# EAGLE design sensorHub (EAGLE 9.6.2)
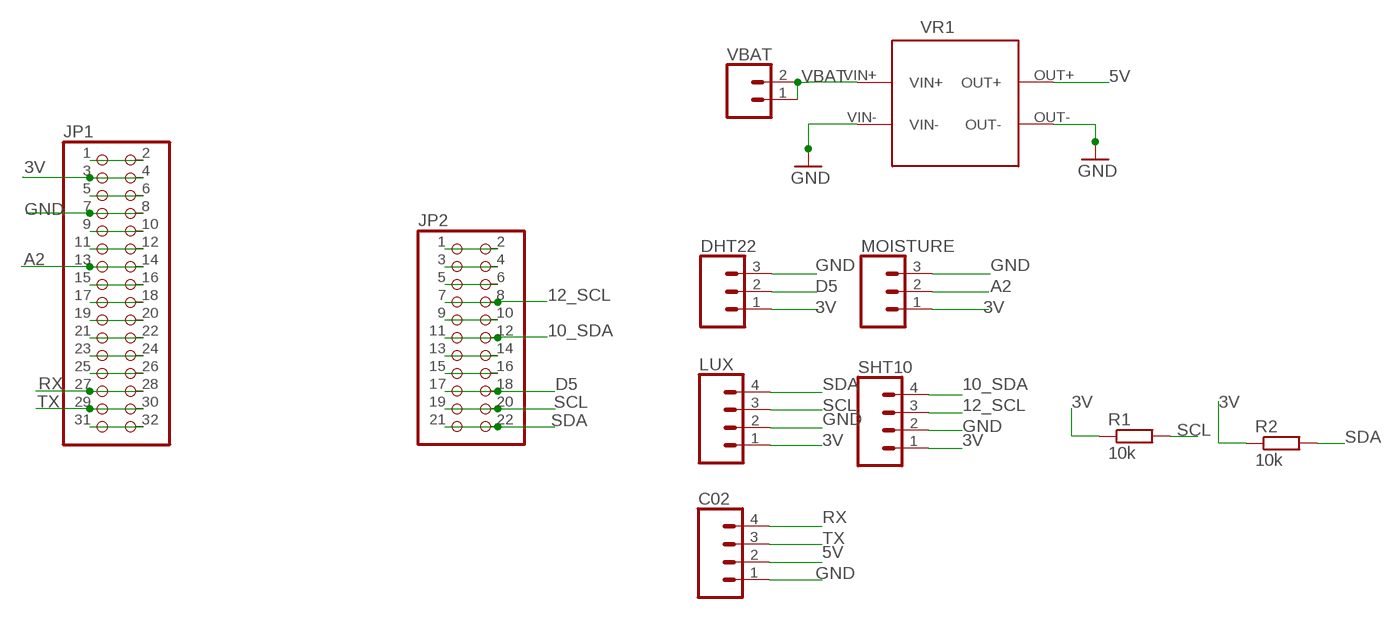
[diagram p0: schematic, sheet 1]

## Parts
C02  CONN_04SCREW  [SCREWTERMINAL-3.5MM-4]
DHT22  CONN_03SCREW  [SCREWTERMINAL-3.5MM-3]
JP1  PINHD-2X16  [2X16]
JP2  PINHD-2X11  [2X11]
LUX  CONN_04SCREW  [SCREWTERMINAL-3.5MM-4]
MOISTURE  CONN_03SCREW  [SCREWTERMINAL-3.5MM-3]
R1  10k  R-EU_0207/10  [0207/10]
R2  10k  R-EU_0207/10  [0207/10]
SHT10  CONN_04SCREW  [SCREWTERMINAL-3.5MM-4]
VBAT  CONN_02  [1X02]
VR1  MT3608THROUGH_HOLE  [MT3608]

## Nets
3V: DHT22.1 JP1.3 JP1.4 LUX.1 MOISTURE.1 R1.1 R2.1 SHT10.1
5V: C02.2 VR1.OUT+
10_SDA: JP2.11 JP2.12 SHT10.4
12_SCL: JP2.7 JP2.8 SHT10.3
A2: JP1.13 JP1.14 MOISTURE.2
D5: DHT22.2 JP2.17 JP2.18
GND: C02.1 DHT22.3 JP1.7 JP1.8 LUX.2 MOISTURE.3 SHT10.2 VR1.OUT- VR1.VIN-
N$1: JP1.1 JP1.2
N$3: JP1.5 JP1.6
N$5: JP1.9 JP1.10
N$6: JP1.11 JP1.12
N$8: JP1.15 JP1.16
N$9: JP1.17 JP1.18
N$10: JP1.19 JP1.20
N$11: JP1.21 JP1.22
N$12: JP1.23 JP1.24
N$13: JP1.25 JP1.26
N$16: JP1.31 JP1.32
N$17: JP2.1 JP2.2
N$18: JP2.3 JP2.4
N$19: JP2.5 JP2.6
N$21: JP2.9 JP2.10
N$23: JP2.13 JP2.14
N$24: JP2.15 JP2.16
RX: C02.4 JP1.27 JP1.28
SCL: JP2.19 JP2.20 LUX.3 R1.2
SDA: JP2.21 JP2.22 LUX.4 R2.2
TX: C02.3 JP1.29 JP1.30
VBAT: VBAT.1 VBAT.2 VR1.VIN+

## Library data of the parts
C02 LUX SHT10 = SparkFun-Connectors:CONN_04: Multi connection point. Often used as Generic Header-pin footprint for 0.1 inch spaced/style header connections On any of the 0.1 inch spaced packages, you can populate with these: Break Away Headers - Straight <https://www.sparkfun.com/products/116> (PRT-00116) Break Away Male Headers - Right Angle <https://www.sparkfun.com/products/553> (PRT-00553) Female Headers <https://www.sparkfun.com/products/115> (PRT-00115) Break Away Headers - Machine Pin <https://www.sparkfun.com/products/117> (PRT-00117) Break Away Female Headers - Swiss Machine Pin <https://www.sparkfun.com/products/743> (PRT-00743) For SCREWTERMINALS and SPRING TERMINALS visit here: Screw Terimnals on SparkFun.com <https://www.sparkfun.com/search/results?term=Screw+Terminals> (5mm/3.5mm/2.54mm spacing) This device is also useful as a general connection point to wire up your design to another part of your project. Our various solder wires solder well into these plated through hole pads. Hook-Up Wire - Assortment (Stranded, 22 AWG) <https://www.sparkfun.com/products/11375> (PRT-11375) Hook-Up Wire - Assortment (Solid Core, 22 AWG) <https://www.sparkfun.com/products/11367> (PRT-11367) View the entire wire category on our website here <https://www.sparkfun.com/categories/141> Special notes: Molex polarized connector foot print use with SKU : PRT-08231 with associated crimp pins and housings. 1MM SMD Version SKU: PRT-10208; PROD_ID: 2xCONN-08399; SF_ID: 2xPRT-08084
DHT22 MOISTURE = SparkFun-Connectors:CONN_03: Multi connection point. Often used as Generic Header-pin footprint for 0.1 inch spaced/style header connections On any of the 0.1 inch spaced packages, you can populate with these: Break Away Headers - Straight <https://www.sparkfun.com/products/116> (PRT-00116) Break Away Male Headers - Right Angle <https://www.sparkfun.com/products/553> (PRT-00553) Female Headers <https://www.sparkfun.com/products/115> (PRT-00115) Break Away Headers - Machine Pin <https://www.sparkfun.com/products/117> (PRT-00117) Break Away Female Headers - Swiss Machine Pin <https://www.sparkfun.com/products/743> (PRT-00743) Stackable Header - 3 Pin (Female, 0.1") <https://www.sparkfun.com/products/13875> (PRT-13875) For SCREWTERMINALS and SPRING TERMINALS visit here: Screw Terimnals on SparkFun.com <https://www.sparkfun.com/search/results?term=Screw+Terminals> (5mm/3.5mm/2.54mm spacing) This device is also useful as a general connection point to wire up your design to another part of your project. Our various solder wires solder well into these plated through hole pads. Hook-Up Wire - Assortment (Stranded, 22 AWG) <https://www.sparkfun.com/products/11375> (PRT-11375) Hook-Up Wire - Assortment (Solid Core, 22 AWG) <https://www.sparkfun.com/products/11367> (PRT-11367) View the entire wire category on our website here <https://www.sparkfun.com/categories/141> Special notes: Molex polarized connector foot print use with SKU : PRT-08232 with associated crimp pins and housings.; PROD_ID: CONN-08288; SF_ID: PRT-08235
JP1 = pinhead:PINHD-2X16: PIN HEADER
JP2 = pinhead:PINHD-2X11: PIN HEADER
R1 R2 = resistor:R-EU_: RESISTOR, European symbol
VBAT = SparkFun-Connectors:CONN_02: Multi connection point. Often used as Generic Header-pin footprint for 0.1 inch spaced/style header connections On any of the 0.1 inch spaced packages, you can populate with these: Break Away Headers - Straight <https://www.sparkfun.com/products/116> (PRT-00116) Break Away Male Headers - Right Angle <https://www.sparkfun.com/products/553> (PRT-00553) Female Headers <https://www.sparkfun.com/products/115> (PRT-00115) Break Away Headers - Machine Pin <https://www.sparkfun.com/products/117> (PRT-00117) Break Away Female Headers - Swiss Machine Pin <https://www.sparkfun.com/products/743> (PRT-00743) For SCREWTERMINALS and SPRING TERMINALS visit here: Screw Terimnals on SparkFun.com <https://www.sparkfun.com/search/results?term=Screw+Terminals> (5mm/3.5mm/2.54mm spacing) This device is also useful as a general connection point to wire up your design to another part of your project. Our various solder wires solder well into these plated through hole pads. Hook-Up Wire - Assortment (Stranded, 22 AWG) <https://www.sparkfun.com/products/11375> (PRT-11375) Hook-Up Wire - Assortment (Solid Core, 22 AWG) <https://www.sparkfun.com/products/11367> (PRT-11367) View the entire wire category on our website here <https://www.sparkfun.com/categories/141> Special notes: Molex polarized connector foot print use with: PRT-08233 with associated crimp pins and housings. 2.54_SCREWTERM for use with PRT-10571. 3.5mm Screw Terminal footprints for PRT-08084 5mm Screw Terminal footprints for use with PRT-08432
VR1 = lm2577_module:MT3608: This is the LM2577 device forMT3608 package with a usb connector

## Board
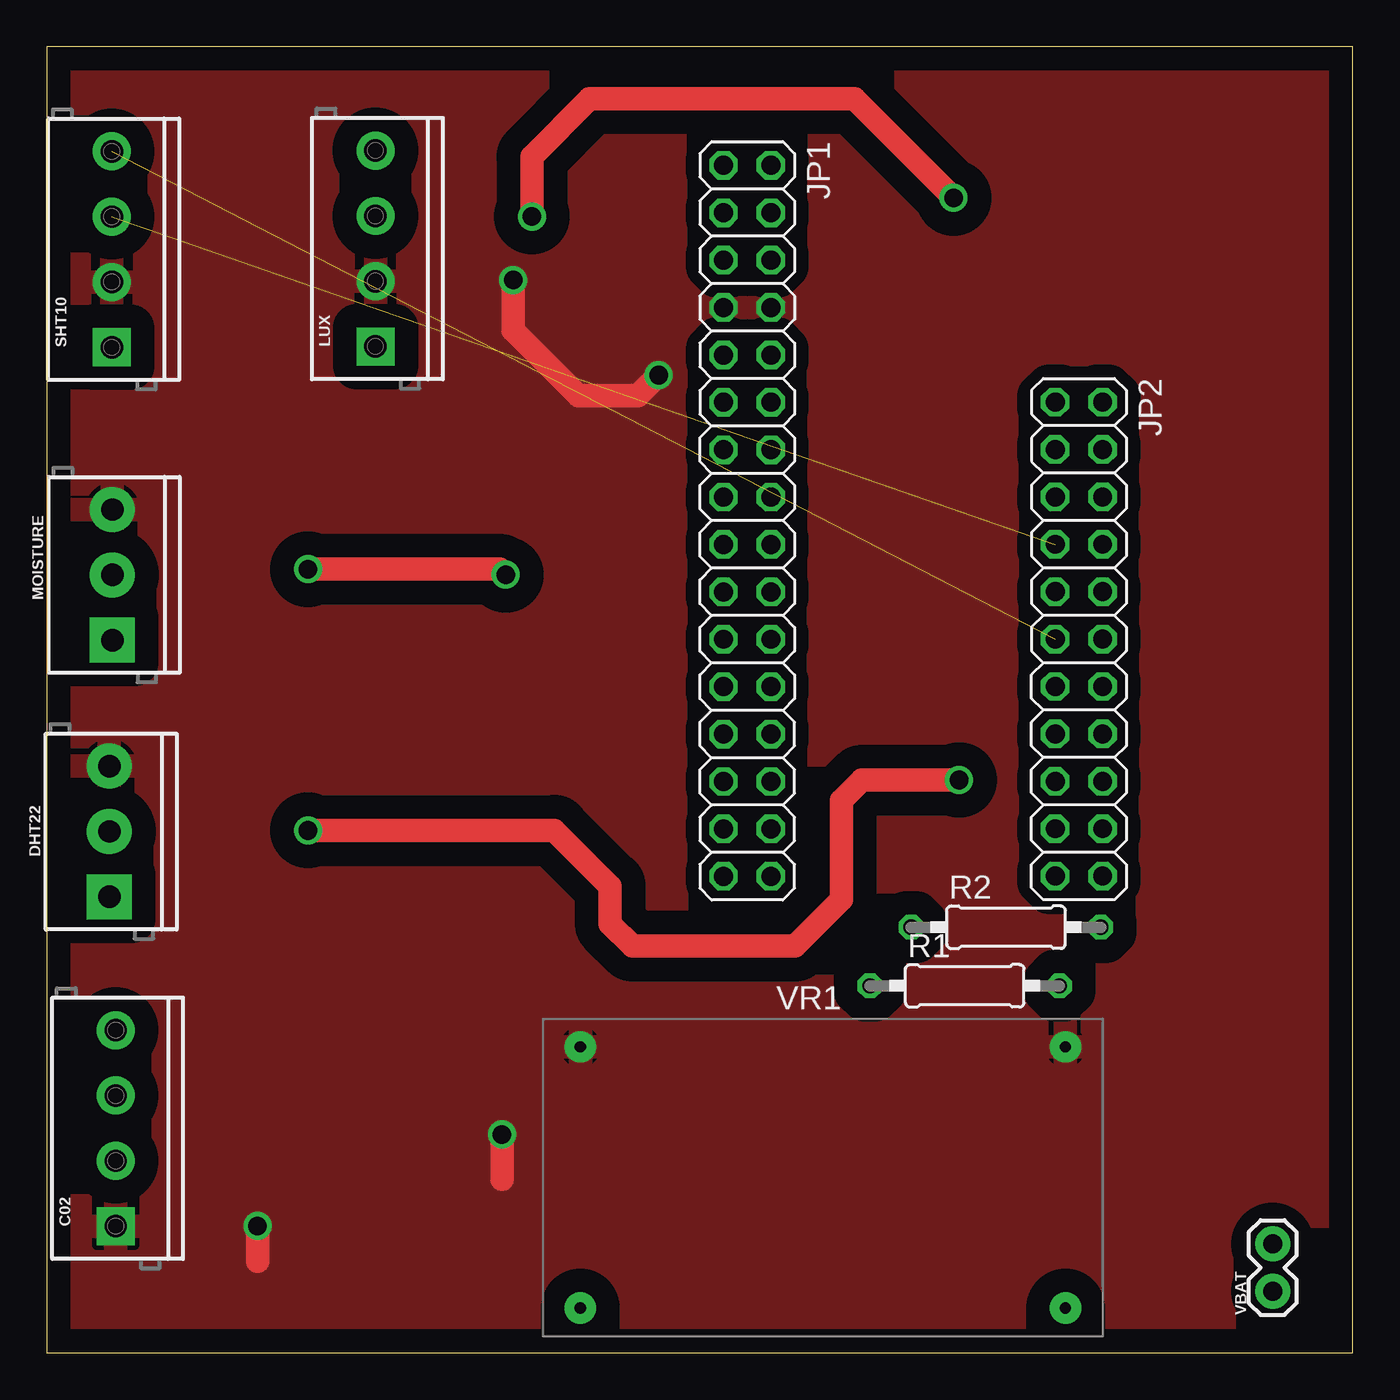
[diagram p1: board, top side]
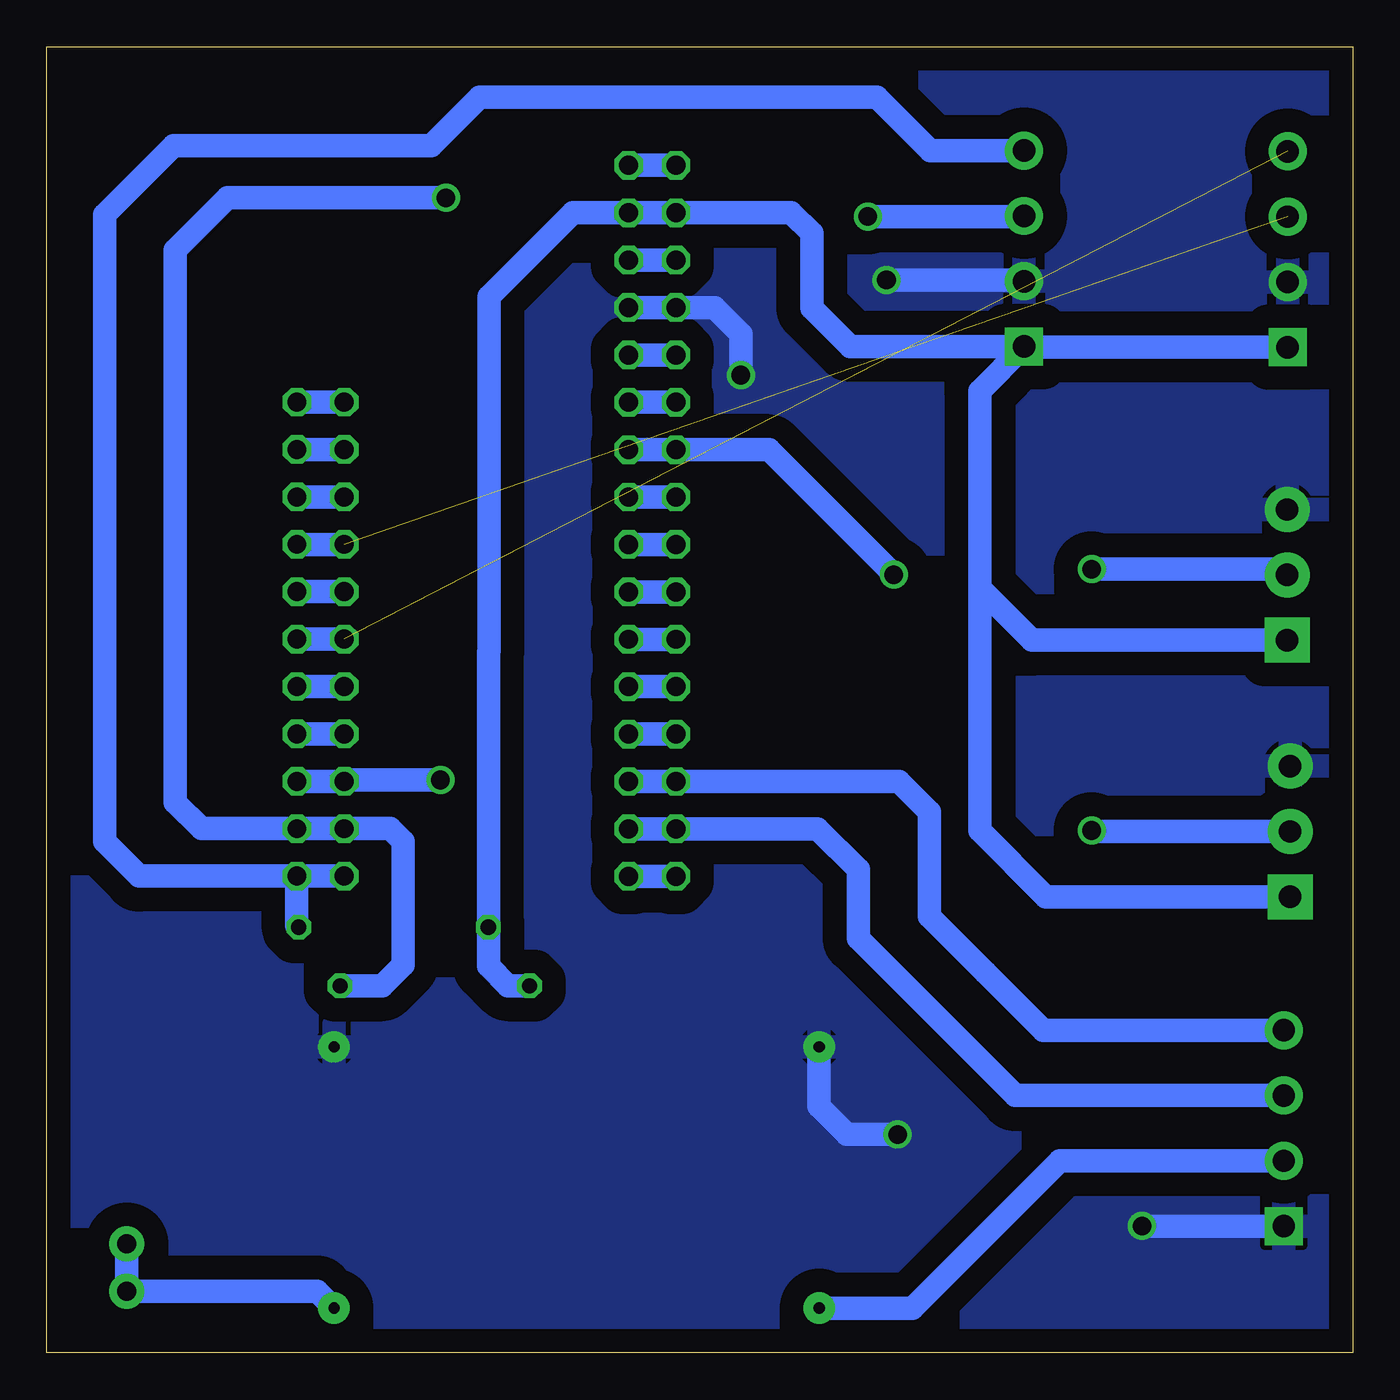
[diagram p2: board, bottom side, seen from below]

Size 70 x 70 mm. Coordinates in mm from the lower left corner, seen from the top.
Outline: 0,0 70,0 70,70 0,70 0,0
Copper layers (1*16): Top 0.035mm / dielectric 1.5mm / Bottom 0.035mm
Design rules "default *": minimum track width 6mil, minimum drill 0.35mm, track to track 1mm, track to pad 1mm, pad to pad 6mil, via to via 1mm, smd to smd 6mil, copper to edge 40mil, drill to drill 6mil, minimum pad ring 10mil, minimum via ring 8mil, stop-mask expansion 4mil, vias tented up to drill 0mil, thermal gap 10mil

### Footprints (pad centres in the part's own frame; a part is rotated, then mirrored left to right if it is on the bottom)
SCREWTERMINAL-3.5MM-4 = drill 1.2 pad 2.032 square: 1 0,0 | drill 1.2 pad 2.032: 2 3.5,0; 3 7,0; 4 10.5,0
SCREWTERMINAL-3.5MM-3 = drill 1.2 pad 2.413 square: 1 0,0 | drill 1.2 pad 2.413: 2 3.5,0; 3 7,0
2X16 = drill 1.016 octagon: 1 -19.05,-1.27; 2 -19.05,1.27; 3 -16.51,-1.27; 4 -16.51,1.27; 5 -13.97,-1.27; 6 -13.97,1.27; 7 -11.43,-1.27; 8 -11.43,1.27; 9 -8.89,-1.27; 10 -8.89,1.27; 11 -6.35,-1.27; 12 -6.35,1.27; 13 -3.81,-1.27; 14 -3.81,1.27; 15 -1.27,-1.27; 16 -1.27,1.27; 17 1.27,-1.27; 18 1.27,1.27; 19 3.81,-1.27; 20 3.81,1.27; 21 6.35,-1.27; 22 6.35,1.27; 23 8.89,-1.27; 24 8.89,1.27; 25 11.43,-1.27; 26 11.43,1.27; 27 13.97,-1.27; 28 13.97,1.27; 29 16.51,-1.27; 30 16.51,1.27; 31 19.05,-1.27; 32 19.05,1.27
2X11 = drill 1.016 octagon: 1 -12.7,-1.27; 2 -12.7,1.27; 3 -10.16,-1.27; 4 -10.16,1.27; 5 -7.62,-1.27; 6 -7.62,1.27; 7 -5.08,-1.27; 8 -5.08,1.27; 9 -2.54,-1.27; 10 -2.54,1.27; 11 0,-1.27; 12 0,1.27; 13 2.54,-1.27; 14 2.54,1.27; 15 5.08,-1.27; 16 5.08,1.27; 17 7.62,-1.27; 18 7.62,1.27; 19 10.16,-1.27; 20 10.16,1.27; 21 12.7,-1.27; 22 12.7,1.27
0207/10 = drill 0.813 octagon: 1 -5.08,0; 2 5.08,0
1X02 = drill 1.016 pad 1.88: 1 0,0; 2 2.54,0
MT3608 = drill 0.6 pad 1.676: OUT+ 14,0; OUT- 0,0; VIN+ 14,26; VIN- 0,26

### Placement (x,y rotation side)
C02  3.7,6.79 90 top
DHT22  3.36,24.44 90 top
JP1  37.54,44.59 270 top
JP2  55.32,38.25 270 top
LUX  17.62,53.93 90 top
MOISTURE  3.52,38.19 90 top
R1  49.2,19.67 0 top
R2  51.41,22.81 0 top
SHT10  3.49,53.89 90 top
VBAT  65.7,3.3 90 top
VR1  28.6,16.4 270 top

### Tracks (layer width: path | path; a pad name or v marks a point on that pad's centre or on a via)
3V
  Bottom 1.27: SHT10.1 17.58,53.89 LUX.1 | MOISTURE.1 17.19,38.19 20,41 | LUX.1 20,51.55 20,41 | 20,41 20,28 16.44,24.44 DHT22.1 | LUX.1 26.93,53.93 29,56 29,60 30.1,61.1 JP1.3 JP1.4 41.8,61.1 46.3,56.6 46.3,37.6 46.33,37.57 R2.1 46.33,20.73 45.27,19.67 R1.1
5V
  Bottom 1.27: C02.2 15.71,10.29 23.6,2.4 VR1.OUT+
10_SDA  (1 unrouted)
  Bottom 1.27: JP2.11 JP2.12
12_SCL  (1 unrouted)
  Bottom 1.27: JP2.7 JP2.8
A2  (via drill 1 pad 1)
  Top 1.27: v24.6,41.7 v24.59,41.69 24.28,42 v14,42
  Bottom 1.27: JP1.14 JP1.13 31.3,48.4 v24.6,41.7 | MOISTURE.2 3.83,42 v14,42
D5  (via drill 1 pad 1)
  Top 1.27: v14,28 27.2,28 30.2,25 30.2,23 31.4,21.8 40.1,21.8 42.6,24.3 42.6,29.6 43.7,30.7 v48.9,30.7
  Bottom 1.27: JP2.18 JP2.17 53.98,30.7 v48.9,30.7 | DHT22.2 13.94,27.94 v14,28
GND  (via drill 1 pad 1)
  Top 1.27: v11.3,6.8 11.3,4.9 | v24.4,11.7 24.4,9.3 | v32.8,52.4 31.7,51.3 28.5,51.3 25,54.8 v25,57.5
  Bottom 1.27: JP1.8 JP1.7 34.22,56.02 32.8,54.6 v32.8,52.4 | C02.1 v11.29,6.79 v11.3,6.8 | VR1.OUT- 28.6,13.2 27.1,11.7 v24.4,11.7 | LUX.2 17.69,57.5 v25,57.5
  pour Bottom (isolate 1.27): 0,0 70,0 70,70 0,70
  pour Top (isolate 1.27): 0,0 70,0 70,70 0,70
N$1
  Bottom 1.27: JP1.1 JP1.2
N$3
  Bottom 1.27: JP1.5 JP1.6
N$5
  Bottom 1.27: JP1.9 JP1.10
N$6
  Bottom 1.27: JP1.11 JP1.12
N$8
  Bottom 1.27: JP1.15 JP1.16
N$9
  Bottom 1.27: JP1.17 JP1.18
N$10
  Bottom 1.27: JP1.19 JP1.20
N$11
  Bottom 1.27: JP1.21 JP1.22
N$12
  Bottom 1.27: JP1.23 JP1.24
N$13
  Bottom 1.27: JP1.25 JP1.26
N$16
  Bottom 1.27: JP1.31 JP1.32
N$17
  Bottom 1.27: JP2.1 JP2.2
N$18
  Bottom 1.27: JP2.3 JP2.4
N$19
  Bottom 1.27: JP2.5 JP2.6
N$21
  Bottom 1.27: JP2.9 JP2.10
N$23
  Bottom 1.27: JP2.13 JP2.14
N$24
  Bottom 1.27: JP2.15 JP2.16
RX
  Bottom 1.27: JP1.28 JP1.27 24.32,30.62 22.7,29 22.7,23.4 19.7,20.4 16.59,17.29 C02.4
SCL  (via drill 1 pad 1)
  Top 1.27: v48.6,61.9 43.3,67.2 29.1,67.2 26,64.1 v26,60.9
  Bottom 1.27: 17.59,60.9 LUX.3 | v48.6,61.9 60.3,61.9 63.1,59.1 63.1,29.5 61.69,28.09 JP2.20 JP2.19 51.59,28.09 50.9,27.4 50.9,20.8 52.03,19.67 R1.2 | v26,60.9 17.59,60.9 | 17.59,60.9 17.58,60.89
SDA
  Bottom 1.27: 17.58,64.39 LUX.4 22.63,64.43 25.5,67.3 46.8,67.3 49.4,64.7 63.2,64.7 66.9,61 66.9,27.4 65.05,25.55 JP2.22 | JP2.21 JP2.22 | JP2.22 56.59,22.91 R2.2
TX
  Bottom 1.27: JP1.30 JP1.29 28.68,28.08 26.5,25.9 26.5,22.2 18.09,13.79 C02.3
VBAT
  Bottom 1.27: VBAT.2 VBAT.1 55.5,3.3 VR1.VIN+